# Altium project MSampler2.PrjPcb
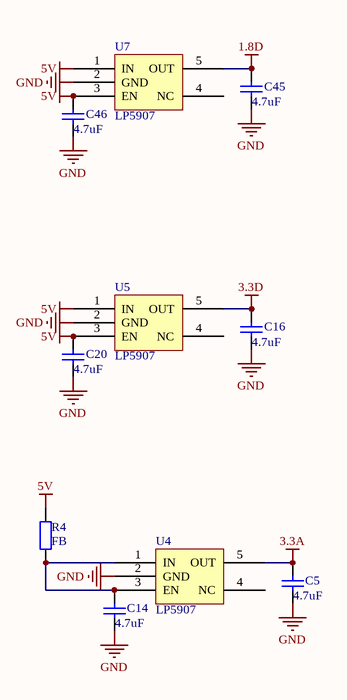
[diagram p0: power.SchDoc]
4 sheets, 56 parts. Net scope: flat (ports and power ports of the same name join across sheets).
Board file: MSampler2.PcbDoc
Sheets:
  power.SchDoc
  audio.SchDoc
  MCU.SchDoc
  audio2.SchDoc

## Sheet power.SchDoc
size A4

### Parts
C5  4.7uF  [0603L]
C14  4.7uF  [0603L]
C16  4.7uF  [0603L]
C20  4.7uF  [0603L]
C45  4.7uF  [0603L]
C46  4.7uF  [0603L]
R4  FB  [0603L]
U4  LP5907  [SOT23-5]
U5  LP5907  [SOT23-5]
U7  LP5907  [SOT23-5]

### Nets
1.8D: C45.2 U7.5(OUT)
3.3A: C5.2 U4.5(OUT)
3.3D: C16.2 U5.5(OUT)
5V: C20.2 C46.2 R4.2 U5.1(IN) U5.3(EN) U7.1(IN) U7.3(EN)
GND: C5.1 C14.1 C16.1 C20.1 C45.1 C46.1 U4.2(GND) U5.2(GND) U7.2(GND)
NetC14_2: C14.2 R4.1 U4.1(IN) U4.3(EN)

Not connected (* = marked no-connect by the designer): U4 4(NC); U5 4(NC); U7 4(NC)

### Library data of the parts
C5 C14 C16 C20 C45 C46 = Cap: Capacitor; Published: 8-Jun-2000; LatestRevisionDate: 17-Jul-2002; LatestRevisionNote: Re-released for DXP Platform.; PackageReference: RAD-0.3; Publisher: Altium Limited; PackageDescription: Radial Cap, Thru-Hole; 2 Leads; 0.3 in Pin Spacing
R4 = Res2: Resistor; Value: 0Ohm; Published: 8-Jun-2000; LatestRevisionDate: 17-Jul-2002; LatestRevisionNote: Re-released for DXP Platform.; PackageReference: AXIAL-0.4; Publisher: Altium Limited; PackageDescription: Axial Device, Thru-Hole; 2 Leads; 0.4 in Pin Spacing

## Sheet audio.SchDoc
size A4
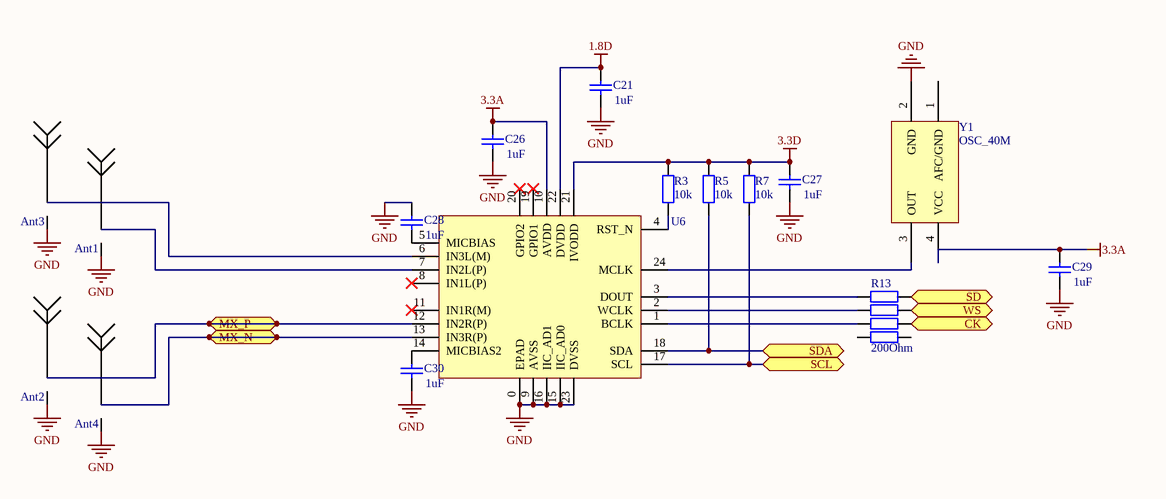
[diagram p1: audio.SchDoc]

### Parts
Ant1  Antenna  [SMA]  (value not drawn)
Ant2  Antenna  [SMA]  (value not drawn)
Ant3  Antenna  [SMA]  (value not drawn)
Ant4  Antenna  [SMA]  (value not drawn)
C21  1uF  [0402]
C26  1uF  [0402]
C27  1uF  [0402]
C28  1uF  [0402]
C29  1uF  [0402]
C30  1uF  [0402]
R3  value 10k  [0402]  (hidden comment: Res2)
R5  value 10k  [0402]  (hidden comment: Res2)
R7  value 10k  [0402]  (hidden comment: Res2)
R13  value 200Ohm  [0402X4]  (hidden comment: Res*4)
U6  TLV320ADC3101  [TLV320ADC3101]  (value not drawn)
Y1  OSC_40M  [TXC_7Q]

### Ports
CK, MX_N, MX_P, SCL, SD, SDA, WS

### Nets
1.8D: C21.2 U6.22(DVDD)
3.3A: C26.2 C29.2 U6.10(AVDD) Y1.4(VCC)
3.3D: C27.2 R3.2 R5.2 R7.2 U6.21(IVODD)
GND: Ant1.GND(G) Ant2.GND(G) Ant3.GND(G) Ant4.GND(G) C21.1 C26.1 C27.1 C28.2 C29.1 C30.1 U6.0(EPAD) U6.9(AVSS) U6.15(IIC_AD0) U6.16(IIC_AD1) U6.23(DVSS) Y1.2(GND)
PA15: R13.3 ; port WS
NetAnt1_1: Ant1.1 U6.7(IN2L(P))
NetAnt2_1: Ant2.1 U6.12(IN2R(P)) ; port MX_P
NetAnt3_1: Ant3.1 U6.6(IN3L(M))
NetAnt4_1: Ant4.1 U6.13(IN3R(P)) ; port MX_N
NetC28_1: C28.1 U6.5(MICBIAS)
NetC30_2: C30.2 U6.14(MICBIAS2)
NetR2_5: R13.2 ; port CK
NetR2_7: R13.4 ; port SD
NetR3_1: R3.1 U6.4(RST_N)
NetR5_1: R5.1 U6.18(SDA) ; port SDA
NetR7_1: R7.1 U6.17(SCL) ; port SCL
NetR13_5: R13.5 U6.3(DOUT)
NetR13_6: R13.6 U6.2(WCLK)
NetR13_7: R13.7 U6.1(BCLK)
NetU6_24: U6.24(MCLK) Y1.3(OUT)

Not connected (* = marked no-connect by the designer): R13 1 8; U6 8(IN1L(P))* 11(IN1R(M))* 19(GPIO1)* 20(GPIO2)*; Y1 1(AFC/GND)

### Library data of the parts
C21 C26-C30 = Cap: Capacitor
R3 R5 R7 = Res2: Resistor; Published: 8-Jun-2000; LatestRevisionDate: 17-Jul-2002; LatestRevisionNote: Re-released for DXP Platform.; PackageReference: AXIAL-0.4; Publisher: Altium Limited; PackageDescription: Axial Device, Thru-Hole; 2 Leads; 0.4 in Pin Spacing
R13 = Res*4: Resistor; Published: 8-Jun-2000; LatestRevisionDate: 17-Jul-2002; LatestRevisionNote: Re-released for DXP Platform.; PackageReference: AXIAL-0.4; Publisher: Altium Limited; PackageDescription: Axial Device, Thru-Hole; 2 Leads; 0.4 in Pin Spacing

## Sheet MCU.SchDoc
size A4
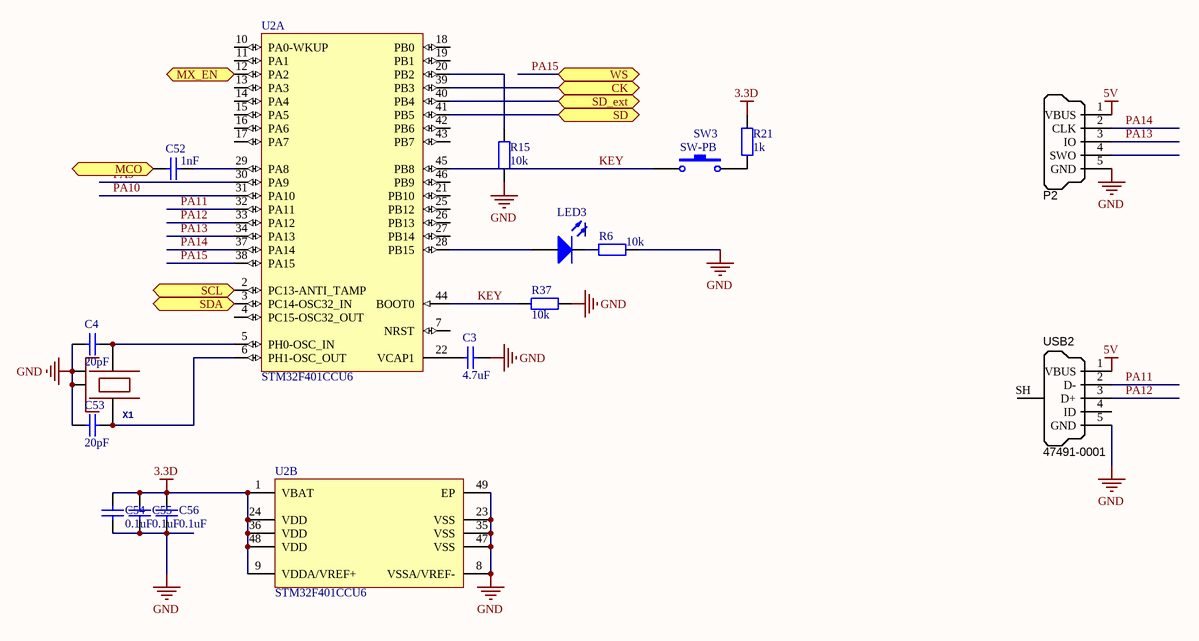
[diagram p2: MCU.SchDoc]

### Parts
C3  value 4.7uF  [0603L]  (hidden comment: Cap)
C4  value 20pF  [0402]  (hidden comment: Cap)
C52  1nF  [0402]
C53  value 20pF  [0402]  (hidden comment: Cap)
C54  value 0.1uF  [0402]  (hidden comment: Cap)
C55  value 0.1uF  [0402]  (hidden comment: Cap)
C56  value 0.1uF  [0402]  (hidden comment: Cap)
LED3  LED0  [0603]  (value not drawn)
P2  SWD_MicroUSB  [MICRO-YZX]  (value not drawn)
R6  10k  [0402]
R15  10k  [0402]
R21  1k  [0402]
R37  value 10k  [0402]  (hidden comment: Res2)
SW3  SW-PB  [SW3x4]
U2  STM32F401CCU6  [STM-UFQFPN48_N]  (parts A,B of 2)
USB2  Manufacturer Part Number 1: 47491-0001  [MICRO-YZX]  (hidden comment: USB Micro Type B)
X1  24.000 KHz 3.2x2.5mm 8-10pf  [OSCILLATOR-2.5x2.0]  (value not drawn)

### Ports
CK, MCO, MX_EN, SCL, SD, SD_ext, SDA, WS

### Nets
3.3D: C54.2 C55.2 C56.2 R21.2 U2.1(VBAT) U2.9(VDDA/VREF+) U2.24(VDD) U2.36(VDD) U2.48(VDD)
5V: P2.1(VBUS) USB2.1(VBUS)
GND: C3.1 C4.1 C53.1 C54.1 C55.1 C56.1 P2.5(GND) R6.2 R15.2 R37.2 U2.8(VSSA/VREF-) U2.23(VSS) U2.35(VSS) U2.47(VSS) U2.49(EP) USB2.5(GND) X1.2(NC_2) X1.4(NC_4)
KEY: R37.1 SW3.1 U2.44(BOOT0) U2.45(PB8)
PA9: U2.30(PA9)
PA10: U2.31(PA10)
PA11: U2.32(PA11) USB2.2(D-)
PA12: U2.33(PA12) USB2.3(D+)
PA13: P2.3(IO) U2.34(PA13)
PA14: P2.2(CLK) U2.37(PA14)
PA15: U2.38(PA15) ; port WS
NetC3_2: C3.2 U2.22(VCAP1)
NetC4_2: C4.2 U2.5(PH0-OSC_IN) X1.1
NetC52_1: C52.1 ; port MCO
NetC52_2: C52.2 U2.29(PA8)
NetC53_2: C53.2 U2.6(PH1-OSC_OUT) X1.3
NetLED3_1: LED3.1(A) U2.28(PB15)
NetLED3_2: LED3.2(K) R6.1
NetR2_5: U2.39(PB3) ; port CK
NetR2_7: U2.41(PB5) ; port SD
NetR5_1: U2.3(PC14-OSC32_IN) ; port SDA
NetR7_1: U2.2(PC13-ANTI_TAMP) ; port SCL
NetR15_1: R15.1 U2.20(PB2)
NetR21_1: R21.1 SW3.2
NetU2_12: U2.12(PA2) ; port MX_EN
NetU2_40: U2.40(PB4) ; port SD_ext

Not connected (* = marked no-connect by the designer): P2 4(SWO); U2 4(PC15-OSC32_OUT) 7(NRST) 10(PA0-WKUP) 11(PA1) 13(PA3) 14(PA4) 15(PA5) 16(PA6) 17(PA7) 18(PB0) 19(PB1) 21(PB10) 25(PB12) 26(PB13) 27(PB14) 42(PB6) 43(PB7) 46(PB9); USB2 4(ID) SH(Shell)

### Library data of the parts
C3 C4 C52-C56 = Cap: Capacitor
  C3 C4 C53-C56: Published: 8-Jun-2000; LatestRevisionDate: 17-Jul-2002; LatestRevisionNote: Re-released for DXP Platform.; PackageReference: RAD-0.3; Publisher: Altium Limited; PackageDescription: Radial Cap, Thru-Hole; 2 Leads; 0.3 in Pin Spacing
LED3 = LED0: Typical INFRARED GaAs LED; Published: 8-Jun-2000; LatestRevisionDate: 08-Jul-2005; LatestRevisionNote: Mech Layer 1 removed.; PackageReference: LED-0; Publisher: Altium Limited; PackageDescription: LED; 2 Leads
P2 = SWD_MicroUSB: Connector SMD USB Micro Type B middle mount; Manufacturer 1: Molex Inc; SCDType: undef; Package / Case: SMD; Supplier 1: Digi-Key; Supplier Part Number 1: WM17142CT-ND
R6 R15 R21 = Res2: Resistor; Value: 0Ohm; Published: 8-Jun-2000; LatestRevisionDate: 17-Jul-2002; LatestRevisionNote: Re-released for DXP Platform.; PackageReference: AXIAL-0.4; Publisher: Altium Limited; PackageDescription: Axial Device, Thru-Hole; 2 Leads; 0.4 in Pin Spacing
R37 = Res2: Resistor; Published: 8-Jun-2000; LatestRevisionDate: 17-Jul-2002; LatestRevisionNote: Re-released for DXP Platform.; PackageReference: AXIAL-0.4; Publisher: Altium Limited; PackageDescription: Axial Device, Thru-Hole; 2 Leads; 0.4 in Pin Spacing
SW3 = SW-PB: Switch; Published: 24-Mar-1999; LatestRevisionDate: 17-Jul-2002; LatestRevisionNote: Re-released for DXP Platform.; PackageReference: SPST-2; Publisher: Altium Limited; PackageDescription: Switch; 2 Leads
U2 = STM32F401CCU6: ARM Cortex-M4 32-bit MCU+FPU, 105 DMIPS, 256 kB Flash, 64 kB Internal RAM, 36 I/Os, 48-pin UFQFPN, -40 to 85 degC, Tray; Manufacturer: STMicroelectronics; FLASH Size (Prog) (kB): 256; I/Os (High Current): 36; Internal RAM Size (kB): 64; Operating Frequency(F) (Processor speed) (MHz): 84; Supply Voltage(Vcc) max (V): 3.6; Supply Voltage(Vcc) min (V): 1.8; DatasheetVersion: Rev. 1; PackageVersion: Rev. 1, 04/2013; PackageReference: UFQFPN48; PackageDescription: 48-Pin Ultra Thin Fine Pitch Quad Flat No-Lead, 7 x 7 x 0.6 mm Body, 0.5 mm Pitch, Exposed Pad; Supplier 1: Newark; Supplier Part Number 1: 19X6217; Supplier 2: Mouser; Supplier Part Number 2: 511-STM32F401CCU6; Core: ARM Cortex-M4; Packing: Tray; Mounting Technology: Surface Mount; PartNumber: STM32F401CCU6; ComponentLink1Description: Manufacturer URL; ComponentLink1URL: http://www.st.com/web/en/home.html; ComponentLink2Description: Datasheet; ComponentLink2URL: http://www.st.com/st-web-ui/static/active/en/resource/technical/document/data_brief/DM00071938.pdf; ComponentLink3Description: Package Specification; ComponentLink3URL: http://www.st.com/st-web-ui/static/active/en/resource/technical/document/data_brief/DM00071938.pdf
USB2 = USB_Micro_TypeB: Connector SMD USB Micro Type B middle mount; Manufacturer 1: Molex Inc; SCDType: undef; Package / Case: SMD; Supplier 1: Digi-Key; Supplier Part Number 1: WM17142CT-ND
X1 = OSCILLATOR-3.2X2.5: Crystal Oscillator in 3.2x2.5 SMD

## Sheet audio2.SchDoc
size A4
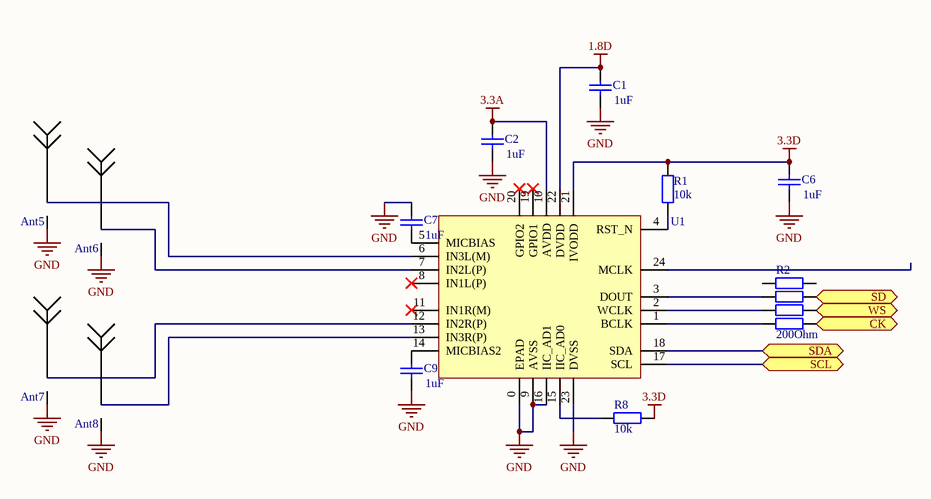
[diagram p3: audio2.SchDoc]

### Parts
Ant5  Antenna  [SMA]  (value not drawn)
Ant6  Antenna  [SMA]  (value not drawn)
Ant7  Antenna  [SMA]  (value not drawn)
Ant8  Antenna  [SMA]  (value not drawn)
C1  1uF  [0402]
C2  1uF  [0402]
C6  1uF  [0402]
C7  1uF  [0402]
C9  1uF  [0402]
R1  value 10k  [0402]  (hidden comment: Res2)
R2  value 200Ohm  [0402X4]  (hidden comment: Res*4)
R8  value 10k  [0402]  (hidden comment: Res2)
U1  TLV320ADC3101  [TLV320ADC3101]  (value not drawn)

### Ports
CK, SCL, SD, SDA, WS

### Nets
1.8D: C1.2 U1.22(DVDD)
3.3A: C2.2 U1.10(AVDD)
3.3D: C6.2 R1.2 R8.1 U1.21(IVODD)
GND: Ant5.GND(G) Ant6.GND(G) Ant7.GND(G) Ant8.GND(G) C1.1 C2.1 C6.1 C7.2 C9.1 U1.0(EPAD) U1.9(AVSS) U1.16(IIC_AD1) U1.23(DVSS)
PA15: R2.6 ; port WS
NetAnt5_1: Ant5.1 U1.6(IN3L(M))
NetAnt6_1: Ant6.1 U1.7(IN2L(P))
NetAnt7_1: Ant7.1 U1.12(IN2R(P))
NetAnt8_1: Ant8.1 U1.13(IN3R(P))
NetC7_1: C7.1 U1.5(MICBIAS)
NetC9_2: C9.2 U1.14(MICBIAS2)
NetR1_1: R1.1 U1.4(RST_N)
NetR2_2: R2.2 U1.3(DOUT)
NetR2_3: R2.3 U1.2(WCLK)
NetR2_4: R2.4 U1.1(BCLK)
NetR2_5: R2.5 ; port CK
NetR2_7: R2.7 ; port SD
NetR5_1: U1.18(SDA) ; port SDA
NetR7_1: U1.17(SCL) ; port SCL
NetR8_2: R8.2 U1.15(IIC_AD0)

Not connected (* = marked no-connect by the designer): R2 1 8; U1 8(IN1L(P))* 11(IN1R(M))* 19(GPIO1)* 20(GPIO2)* 24(MCLK)

### Library data of the parts
C1 C2 C6 C7 C9 = Cap: Capacitor
R1 R8 = Res2: Resistor; Published: 8-Jun-2000; LatestRevisionDate: 17-Jul-2002; LatestRevisionNote: Re-released for DXP Platform.; PackageReference: AXIAL-0.4; Publisher: Altium Limited; PackageDescription: Axial Device, Thru-Hole; 2 Leads; 0.4 in Pin Spacing
R2 = Res*4: Resistor; Published: 8-Jun-2000; LatestRevisionDate: 17-Jul-2002; LatestRevisionNote: Re-released for DXP Platform.; PackageReference: AXIAL-0.4; Publisher: Altium Limited; PackageDescription: Axial Device, Thru-Hole; 2 Leads; 0.4 in Pin Spacing

## Nets that join several sheets
1.8D: power (C45.2 U7.5), audio (C21.2 U6.22), audio2 (C1.2 U1.22)
3.3A: power (C5.2 U4.5), audio (C26.2 C29.2 U6.10 Y1.4), audio2 (C2.2 U1.10)
3.3D: power (C16.2 U5.5), audio (5 pins), MCU (9 pins), audio2 (C6.2 R1.2 R8.1 U1.21)
5V: power (7 pins), MCU (P2.1 USB2.1)
GND: power (9 pins), audio (16 pins), MCU (18 pins), audio2 (13 pins)
NetR2_5: audio (R13.2), MCU (U2.39), audio2 (R2.5)
NetR2_7: audio (R13.4), MCU (U2.41), audio2 (R2.7)
NetR5_1: audio (R5.1 U6.18), MCU (U2.3), audio2 (U1.18)
NetR7_1: audio (R7.1 U6.17), MCU (U2.2), audio2 (U1.17)
PA15: audio (R13.3), MCU (U2.38), audio2 (R2.6)